# Altium project Project2Altium.PrjPcb
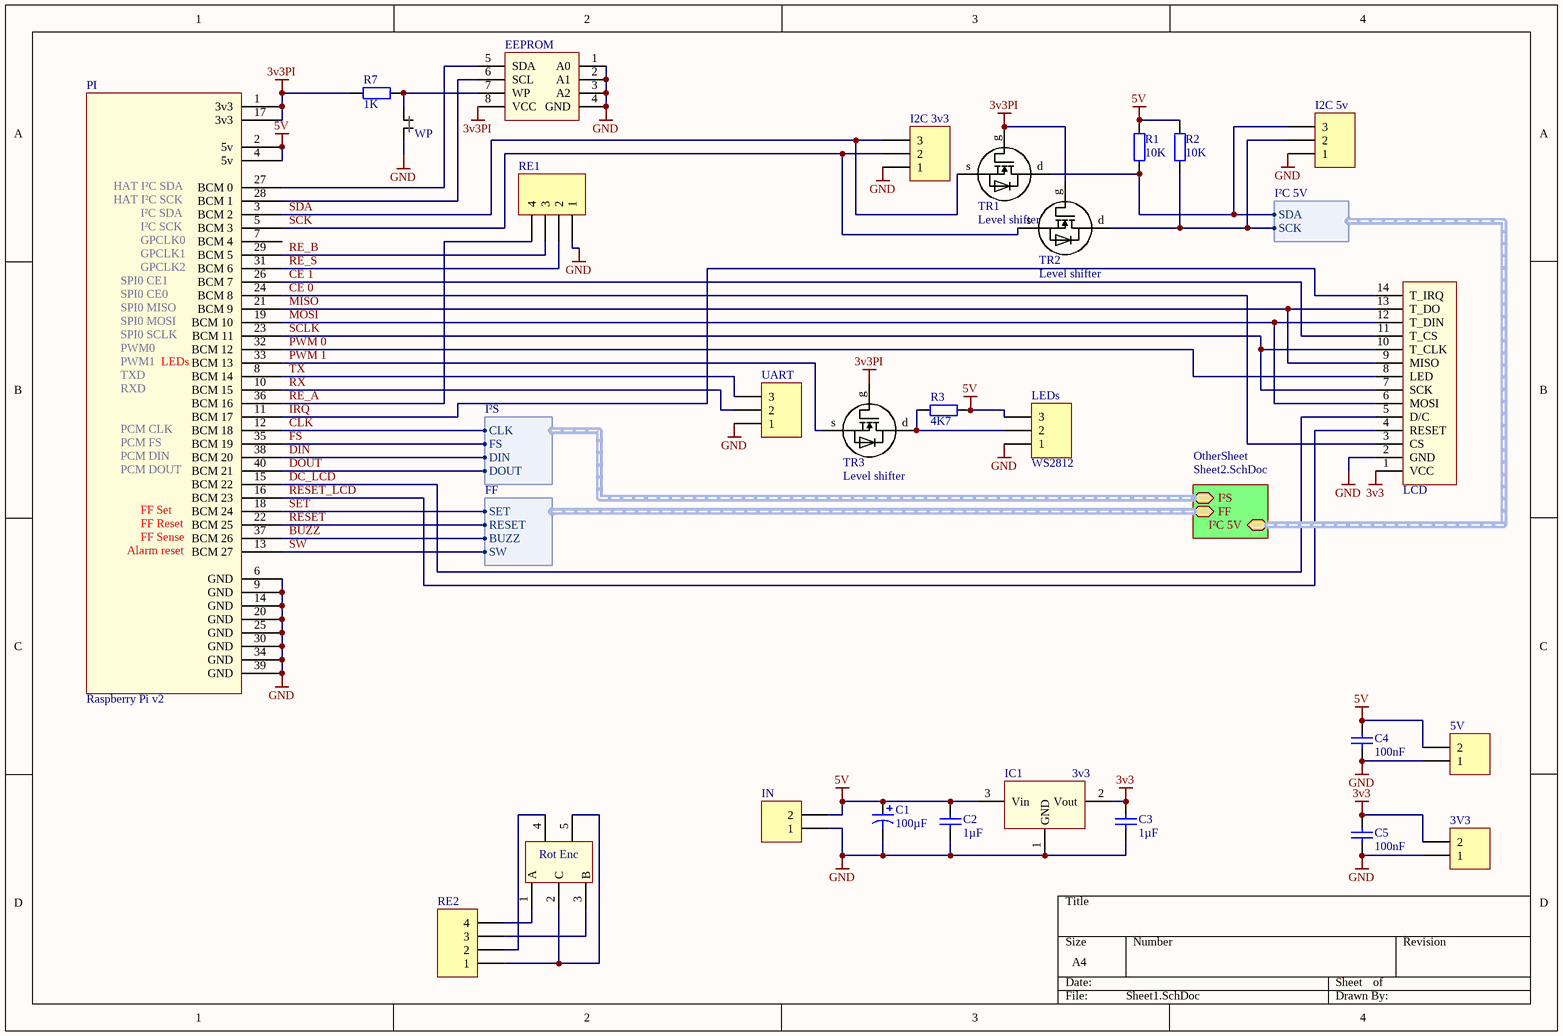
[diagram p0: Sheet1.SchDoc]
2 sheets, 59 parts. Net scope: hierarchical (ports join the sheet entries above them; power ports are global).
Board file: Project2_C.PcbDoc
Sheets:
  Sheet1.SchDoc
    OtherSheet = Sheet2.SchDoc

## Sheet Sheet1.SchDoc
size A4

### Parts
3V3  (no value)  [HDR1X2]
5V  (no value)  [HDR1X2]
C1  value 100µF  [SMD cap 6x5]
C2  value 1µF  [C0805]
C3  value 1µF  [C0805]
C4  value 100nF  [C0805]
C5  value 100nF  [C0805]
EEPROM  I²C SERIAL EEPROM  [SOIC-8]  (value not drawn)
I2C_3v3  (no value)  [HDR1X3]
I2C_5v  (no value)  [HDR1X3]
IC1  3v3  [SOT-23A]
IN  (no value)  [HDR1X2]
LCD  TJCTM24024-SPI  (value not drawn)
LEDs  WS2812  [HDR1X3]
PI  Raspberry Pi v2  [HDR2x10]
R1  value 10K  [C1206]
R2  value 10K  [C1206]
R3  value 4K7  [C1206]
R7  value 1K  [C1206]
RE  (no value)  [EC11E-WP]
RE1  RotaryEncoder  [HDR1X4]  (value not drawn)
RE2  RotaryEncoder  [HDR1X4]  (value not drawn)
TR1  Level shifter  [SOT-23A]
TR2  Level shifter  [SOT-23A]
TR3  Level shifter  [SOT-23A]
UART  (no value)  [HDR1X3]
WP  Jumper  [HDR1X2]  (value not drawn)

### Sub-sheets
OtherSheet = Sheet2.SchDoc: FF (harness FF), I²S (harness I²S), I²C 5V (harness I²C 5V)

### Harnesses
I²S: CLK, FS, DIN, DOUT
I²C 5V: SDA, SCK
FF: SET, RESET, BUZZ, SW

### Nets
3v3: 3V3.2 C3.2 C5.1 IC1.2(Vout) LCD.1(VCC)
3v3PI: EEPROM.8(VCC) PI.1(3v3) PI.17(3v3) R7.2 TR1.g TR2.g TR3.g
5V: 5V.2 C1.1 C2.2 C4.2 IC1.3(Vin) IN.2 LEDs.3 PI.2(5v) PI.4(5v) R1.2 R2.2 R3.1
GND: 3V3.1 5V.1 C1.2 C2.1 C3.1 C4.1 C5.2 EEPROM.1(A0) EEPROM.2(A1) EEPROM.3(A2) EEPROM.4(GND) I2C_3v3.1 I2C_5v.1 IC1.1(GND) IN.1 LCD.2(GND) LEDs.1 PI.6(GND) PI.9(GND) PI.14(GND) PI.20(GND) PI.25(GND) PI.30(GND) PI.34(GND) PI.39(GND) RE1.1 UART.1 WP.1
BUZZ: PI.37(BCM_26) ; sheet OtherSheet/FF.BUZZ
CE 0: LCD.3(CS) PI.24(BCM_8)
CE 1: LCD.11(T_CS) PI.26(BCM_7)
CLK: PI.12(BCM_18) ; sheet OtherSheet/I²S.CLK
DC_LCD: LCD.5(D/C) PI.15(BCM_22)
DIN: PI.38(BCM_20) ; sheet OtherSheet/I²S.DIN
DOUT: PI.40(BCM_21) ; sheet OtherSheet/I²S.DOUT
FS: PI.35(BCM_19) ; sheet OtherSheet/I²S.FS
IRQ: LCD.14(T_IRQ) PI.11(BCM_17)
MISO: LCD.9(MISO) LCD.13(T_DO) PI.21(BCM_9)
MOSI: LCD.6(MOSI) LCD.12(T_DIN) PI.19(BCM_10)
PWM 0: LCD.8(LED) PI.32(BCM_12)
PWM 1: PI.33(BCM_13) TR3.s
RE_A: PI.36(BCM_16) RE1.4
RE_B: PI.29(BCM_5) RE1.3
RE_S: PI.31(BCM_6) RE1.2
RESET: PI.22(BCM_25) ; sheet OtherSheet/FF.RESET
RESET_LCD: LCD.4(RESET) PI.16(BCM_23)
RX: PI.10(BCM_15) UART.2
SCK: I2C_3v3.2 PI.5(BCM_3) TR2.s
SCLK: LCD.7(SCK) LCD.10(T_CLK) PI.23(BCM_11)
SDA: I2C_3v3.3 PI.3(BCM_2) TR1.s
SET: PI.18(BCM_24) ; sheet OtherSheet/FF.SET
SW: PI.13(BCM_27) ; sheet OtherSheet/FF.SW
TX: PI.8(BCM_14) UART.3
NetEEPROM_5: EEPROM.5(SDA) PI.27(BCM_0)
NetEEPROM_6: EEPROM.6(SCL) PI.28(BCM_1)
NetEEPROM_7: EEPROM.7(WP) R7.1 WP.2
NetI2C_5v_2: I2C_5v.2 R2.1 TR2.d ; sheet OtherSheet/I²C 5V.SCK
NetI2C_5v_3: I2C_5v.3 R1.1 TR1.d ; sheet OtherSheet/I²C 5V.SDA
NetLEDs_2: LEDs.2 R3.2 TR3.d
NetRE_1: RE.1(A) RE2.4
NetRE_2: RE.2(C) RE.5(F) RE2.1
NetRE_3: RE.3(B) RE2.3
NetRE_4: RE.4(E) RE2.2

Not connected (* = marked no-connect by the designer): PI 7(BCM_4)

### Notes on the sheet
- LEDs
- FF Set
- (near PI) Alarm reset
- (near PI) FF Sense
- (near PI) FF Reset
- (in symbol RaspberryPiV2) HAT I²C SDA; HAT I²C SCK; I²C SDA; I²C SCK; GPCLK0; GPCLK1; GPCLK2; SPI0 CE1; SPI0 CE0; SPI0 MISO; SPI0 MOSI; SPI0 SCLK; PWM0; PWM1; TXD; RXD; PCM CLK; PCM FS; PCM DIN; PCM DOUT
- (in symbol RotaryEncoder) Rot Enc

### Library data of the parts
3V3 5V IN = Header 2: Header, 2-Pin; LatestRevisionDate: 17-Jul-2002; LatestRevisionNote: Re-released for DXP Platform.; Publisher: Altium Limited
C1 = Cap Pol1: Polarized Capacitor (Radial); Published: 8-Jun-2000; LatestRevisionDate: 17-Jul-2002; LatestRevisionNote: Re-released for DXP Platform.; PackageReference: RB7.6-15; Publisher: Altium Limited; PackageDescription: Polarized Capacitor (Radial); 2 Leads
C2-C5 = Cap: Capacitor; Published: 8-Jun-2000; LatestRevisionDate: 17-Jul-2002; LatestRevisionNote: Re-released for DXP Platform.; PackageReference: RAD-0.3; Publisher: Altium Limited; PackageDescription: Radial Cap, Thru-Hole; 2 Leads; 0.3 in Pin Spacing
I2C_3v3 I2C_5v LEDs UART = Header 3: Header, 3-Pin; LatestRevisionDate: 17-Jul-2002; LatestRevisionNote: Re-released for DXP Platform.; Publisher: Altium Limited
IC1 = MCP1703: Power regulator
LCD = TJCTM24024-SPI: LCD module
PI = RaspberryPiV2: Raspberry Pi v2 Header
R1-R3 R7 = Res2: Resistor; Published: 8-Jun-2000; LatestRevisionDate: 17-Jul-2002; LatestRevisionNote: Re-released for DXP Platform.; PackageReference: AXIAL-0.4; Publisher: Altium Limited; PackageDescription: Axial Device, Thru-Hole; 2 Leads; 0.4 in Pin Spacing
RE = RotaryEncoder
RE1 RE2 = Header 4: Header, 4-Pin; LatestRevisionDate: 17-Jul-2002; LatestRevisionNote: Re-released for DXP Platform.; Publisher: Altium Limited
TR1-TR3 = AN10441: pin to pad: d>3 g>1 s>2

## Sheet Sheet2.SchDoc
size A4
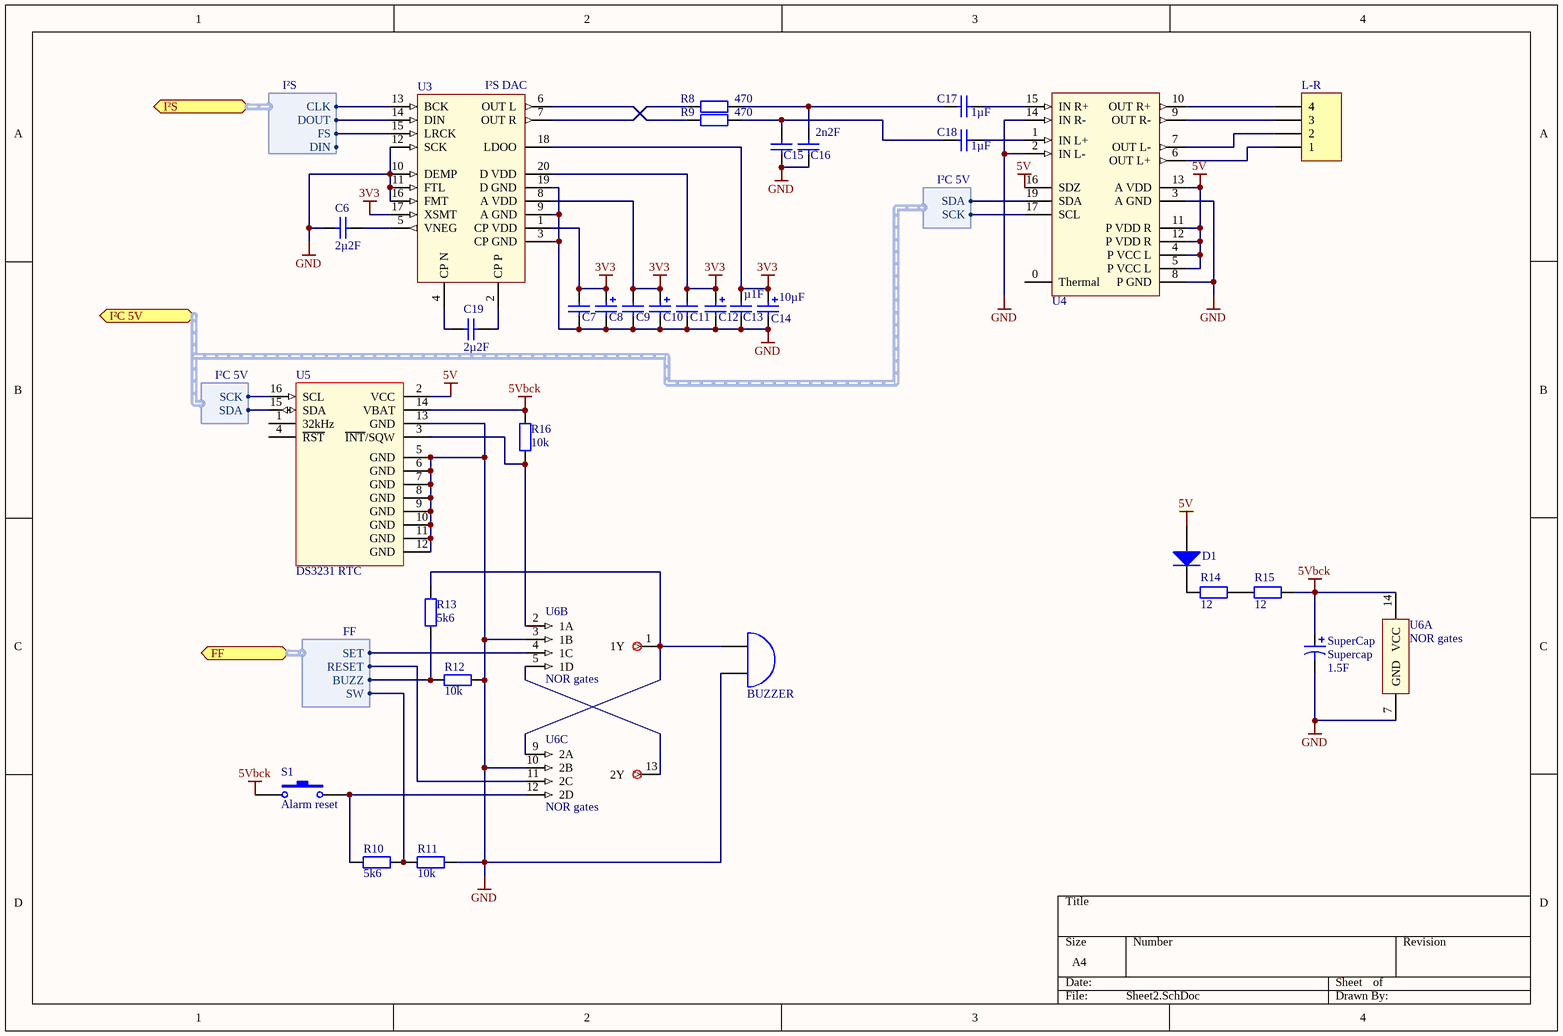
[diagram p1: Sheet2.SchDoc]

### Parts
BUZZER  (no value)  [HDR1X2]
C6  value 2µ2F  [C0805]
C7  value µ1F  [C0805]
C8  (no value)  [SMD cap 6x5]
C9  (no value)  [C0805]
C10  (no value)  [SMD cap 6x5]
C11  (no value)  [C0805]
C12  (no value)  [SMD cap 6x5]
C13  (no value)  [C0805]
C14  value 10µF  [SMD cap 6x5]
C15  (no value)  [C0805]
C16  value 2n2F  [C0805]
C17  value 1µF  [C0805]
C18  value 1µF  [C0805]
C19  value 2µ2F  [C0805]
D1  (no value)  [AXIAL-0.3]
L-R  Header 4  [HDR1X4]  (value not drawn)
R8  value 470  [C1206]
R9  value 470  [C1206]
R10  value 5k6  [C1206]
R11  value 10k  [C1206]
R12  value 10k  [C1206]
R13  value 5k6  [C1206]
R14  value 12  [C1206]
R15  value 12  [C1206]
R16  value 10k  [C1206]
S1  Alarm reset  [HDR1X2]
SuperCap  Supercap  value 1.5F  [HDR1X2]
U3  I²S DAC  [TSSOP-20]
U4  TPA2016D2  [QFN20-tpa2016d2]  (value not drawn)
U5  DS3231 RTC  [DS3231 SO-16]
U6  NOR gates  [SOIC-14]  (parts A,B,C of 3)

### Ports
FF (harness FF), I²C 5V (harness I²C 5V), I²S (harness I²S)

### Harnesses
I²S: CLK, FS, DOUT, DIN
I²C 5V: SCK, SDA
FF: SET, RESET, BUZZ, SW

### Nets
3v3: C7.1 C8.1 C9.1 C10.1 C11.2 C12.1 C13.1 C14.1 U3.1(CP_VDD) U3.8(A_VDD) U3.17(XSMT) U3.18(LDOO) U3.20(D_VDD)
5V: D1.1(A) U4.4(P_VCC_L) U4.5(P_VCC_L) U4.11(P_VDD_R) U4.12(P_VDD_R) U4.13(A_VDD) U4.16(SDZ) U5.2(VCC)
5Vbck: R15.2 R16.2 S1.1 SuperCap.1 U5.14(VBAT) U6.14(VCC)
GND: BUZZER.1(A) C6.1 C7.2 C8.2 C9.2 C10.2 C11.1 C12.2 C13.2 C14.2 C15.2 C16.2 R11.1 R12.1 SuperCap.2 U3.3(CP_GND) U3.9(A_GND) U3.10(DEMP) U3.11(FTL) U3.12(SCK) U3.16(FMT) U3.19(D_GND) U4.2(IN_L-) U4.3(A_GND) U4.8(P_GND) U4.14(IN_R-) U5.5(GND) U5.6(GND) U5.7(GND) U5.8(GND) U5.9(GND) U5.10(GND) U5.11(GND) U5.12(GND) U5.13(GND) U6.3(1B) U6.7(GND) U6.10(2B)
BUZZ: R12.2 R13.2 ; port FF.BUZZ
CLK: U3.13(BCK) ; port I²S.CLK
DOUT: U3.14(DIN) ; port I²S.DOUT
FS: U3.15(LRCK) ; port I²S.FS
RESET: U6.11(2C) ; port FF.RESET
SET: U6.4(1C) ; port FF.SET
SW: R10.1 R11.2 ; port FF.SW
NetBUZZER_2: BUZZER.2(B) R13.1 U6.1(1Y) U6.9(2A)
NetC6_2: C6.2 U3.5(VNEG)
NetC15_1: C15.1 C18.2 R9.2
NetC16_1: C16.1 C17.2 R8.2
NetC17_1: C17.1 U4.15(IN_R+)
NetC18_1: C18.1 U4.1(IN_L+)
NetC19_1: C19.1 U3.2(CP_P)
NetC19_2: C19.2 U3.4(CP_N)
NetD1_2: D1.2(K) R14.1
NetI2C_5v_2: U4.17(SCL) U5.16(SCL) ; port I²C 5V.SCK
NetI2C_5v_3: U4.19(SDA) U5.15(SDA) ; port I²C 5V.SDA
NetL-R_1: L-R.1 U4.6(OUT_L+)
NetL-R_2: L-R.2 U4.7(OUT_L-)
NetL-R_3: L-R.3 U4.9(OUT_R-)
NetL-R_4: L-R.4 U4.10(OUT_R+)
NetR8_1: R8.1 U3.7(OUT_R)
NetR9_1: R9.1 U3.6(OUT_L)
NetR10_2: R10.2 S1.2 U6.12(2D)
NetR14_2: R14.2 R15.1
NetR16_1: R16.1 U5.3(~{INT}/SQW) U6.2(1A)
NetU6_5: U6.5(1D) U6.13(2Y)

Not connected (* = marked no-connect by the designer): U4 0(Thermal); U5 1(32kHz) 4(~{RST})

### Library data of the parts
BUZZER = Bell: Electrical Bell; Published: 24-Mar-1999; LatestRevisionDate: 17-Jul-2002; LatestRevisionNote: Re-released for DXP Platform.; PackageReference: PIN2; Publisher: Altium Limited
C6 C7 C16-C19 = Cap: Capacitor; Published: 8-Jun-2000; LatestRevisionDate: 17-Jul-2002; LatestRevisionNote: Re-released for DXP Platform.; PackageReference: RAD-0.3; Publisher: Altium Limited; PackageDescription: Radial Cap, Thru-Hole; 2 Leads; 0.3 in Pin Spacing
C8 C10 C12 = Cap Pol2: Polarized Capacitor (Axial); Value: 10µF; Published: 8-Jun-2000; LatestRevisionDate: 17-Jul-2002; LatestRevisionNote: Re-released for DXP Platform.; PackageReference: POLAR0.8; Publisher: Altium Limited; PackageDescription: Polarized Capacitor; 2 Leads
C9 C11 C13 = Cap: Capacitor; Value: 0.1µF; Published: 8-Jun-2000; LatestRevisionDate: 17-Jul-2002; LatestRevisionNote: Re-released for DXP Platform.; PackageReference: RAD-0.3; Publisher: Altium Limited; PackageDescription: Radial Cap, Thru-Hole; 2 Leads; 0.3 in Pin Spacing
C14 = Cap Pol2: Polarized Capacitor (Axial); Published: 8-Jun-2000; LatestRevisionDate: 17-Jul-2002; LatestRevisionNote: Re-released for DXP Platform.; PackageReference: POLAR0.8; Publisher: Altium Limited; PackageDescription: Polarized Capacitor; 2 Leads
C15 = Cap: Capacitor; Value: 2n2F; Published: 8-Jun-2000; LatestRevisionDate: 17-Jul-2002; LatestRevisionNote: Re-released for DXP Platform.; PackageReference: RAD-0.3; Publisher: Altium Limited; PackageDescription: Radial Cap, Thru-Hole; 2 Leads; 0.3 in Pin Spacing
D1 = Diode: Default Diode; Published: 8-Jun-2000; LatestRevisionDate: 17-Jul-2002; LatestRevisionNote: Re-released for DXP Platform.; PackageVersion: Sep-1996; PackageReference: SMC; Publisher: Altium Limited; PackageDescription: DO-214-AB/SMC; 2 C-Bend Leads; Body 7.9 x 5.9 mm, inc. leads (LxW); Code_JEDEC: DO-214-AB
L-R = Header 4: Header, 4-Pin; LatestRevisionDate: 17-Jul-2002; LatestRevisionNote: Re-released for DXP Platform.; Publisher: Altium Limited
R8-R16 = Res2: Resistor; Published: 8-Jun-2000; LatestRevisionDate: 17-Jul-2002; LatestRevisionNote: Re-released for DXP Platform.; PackageReference: AXIAL-0.4; Publisher: Altium Limited; PackageDescription: Axial Device, Thru-Hole; 2 Leads; 0.4 in Pin Spacing
S1 = SW-PB: Switch; Published: 24-Mar-1999; LatestRevisionDate: 17-Jul-2002; LatestRevisionNote: Re-released for DXP Platform.; PackageReference: SPST-2; Publisher: Altium Limited; PackageDescription: Switch; 2 Leads
SuperCap = Cap Pol1: Polarized Capacitor (Radial); pin to pad: 1>2 2>1; Published: 8-Jun-2000; LatestRevisionDate: 17-Jul-2002; LatestRevisionNote: Re-released for DXP Platform.; PackageReference: RB7.6-15; Publisher: Altium Limited; PackageDescription: Polarized Capacitor (Radial); 2 Leads
U3 = PCM5102A
U4 = TPA2016D2: I²C Audio Amplifier
U5 = DS3231: RTC
U6 = 744002: Dual 4-input NOR gate

## Nets that join several sheets
3v3: Sheet1 (5 pins), Sheet2 (13 pins)
5V: Sheet1 (12 pins), Sheet2 (8 pins)
GND: Sheet1 (28 pins), Sheet2 (38 pins)
BUZZ: Sheet1 (PI.37), Sheet2 (R12.2 R13.2)
CLK: Sheet1 (PI.12), Sheet2 (U3.13)
DOUT: Sheet1 (PI.40), Sheet2 (U3.14)
FS: Sheet1 (PI.35), Sheet2 (U3.15)
NetI2C_5v_2: Sheet1 (I2C_5v.2 R2.1 TR2.d), Sheet2 (U4.17 U5.16)
NetI2C_5v_3: Sheet1 (I2C_5v.3 R1.1 TR1.d), Sheet2 (U4.19 U5.15)
RESET: Sheet1 (PI.22), Sheet2 (U6.11)
SET: Sheet1 (PI.18), Sheet2 (U6.4)
SW: Sheet1 (PI.13), Sheet2 (R10.1 R11.2)